# EAGLE design WordClock (EAGLE 6.0)
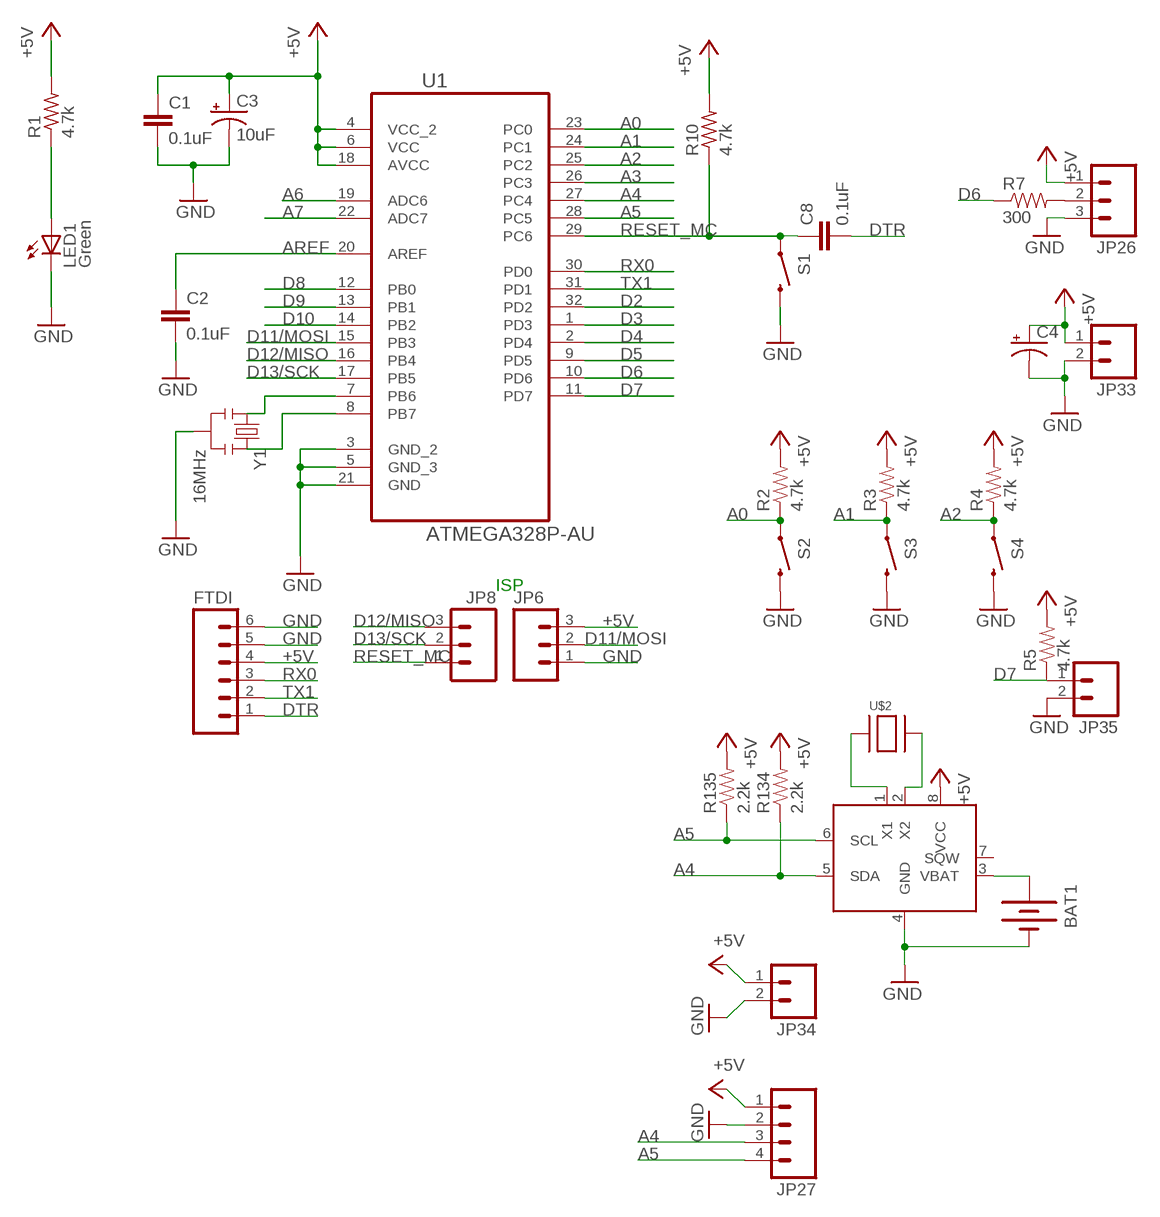
[diagram p0: schematic, sheet 1, part 1 of 2]
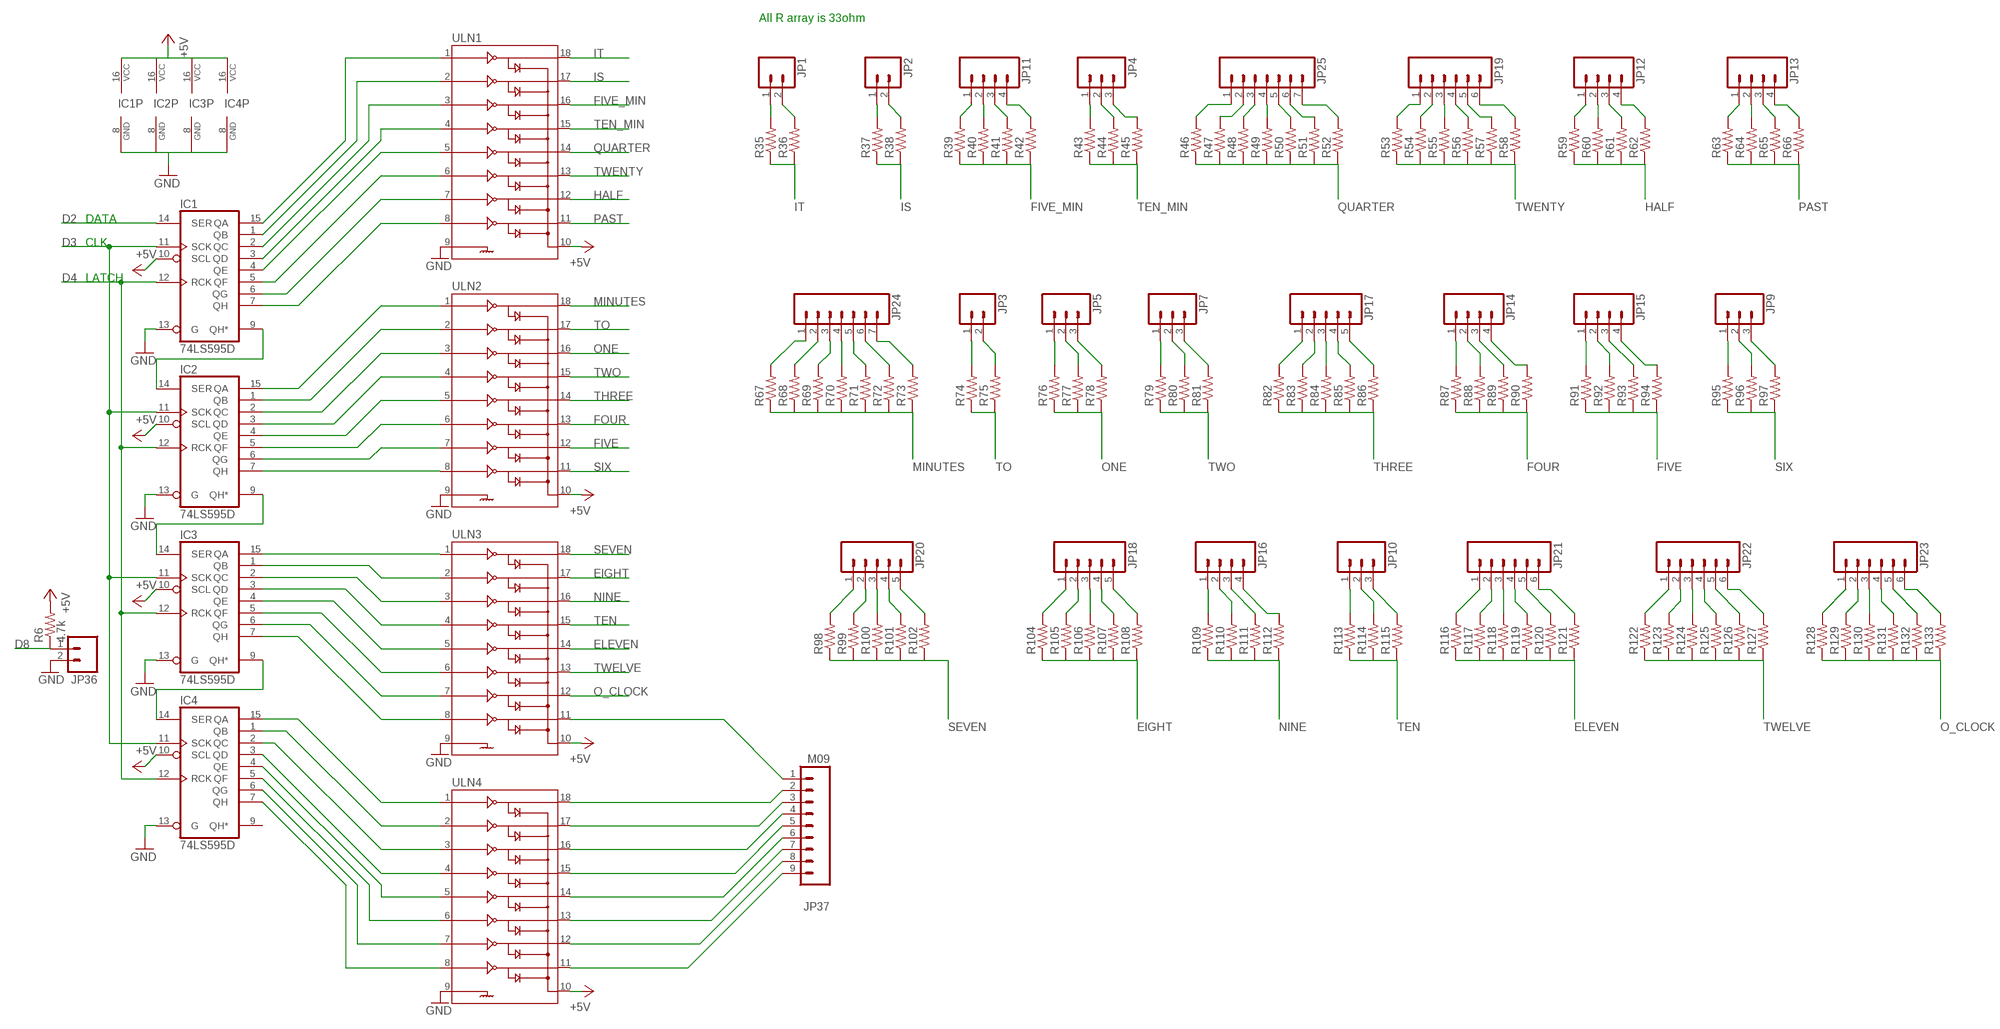
[diagram p1: schematic, sheet 1, part 2 of 2]

## Parts
BAT1  BATTERY12MM  [BATTCON_12MM]
C1  0.1uF  CAP0402-CAP  [0402-CAP]
C2  0.1uF  CAP0402-CAP  [0402-CAP]
C3  10uF  CAP_POL1206  [EIA3216]
C4  CPOL-USF  [PANASONIC_F]
C8  0.1uF  CAP0402-CAP  [0402-CAP]
FTDI  M06SIP  [1X06]
IC1  74LS595D  [SO16]
IC2  74LS595D  [SO16]
IC3  74LS595D  [SO16]
IC4  74LS595D  [SO16]
JP1  M02PTH  [1X02]
JP2  M02PTH  [1X02]
JP3  M02PTH  [1X02]
JP4  M03PTH  [1X03]
JP5  M03PTH  [1X03]
JP6  M03PTH  [1X03]
JP7  M03PTH  [1X03]
JP8  M03PTH  [1X03]
JP9  M03PTH  [1X03]
JP10  M03PTH  [1X03]
JP11  M04PTH  [1X04]
JP12  M04PTH  [1X04]
JP13  M04PTH  [1X04]
JP14  M04PTH  [1X04]
JP15  M04PTH  [1X04]
JP16  M04PTH  [1X04]
JP17  M05PTH  [1X05]
JP18  M05PTH  [1X05]
JP19  M06SIP  [1X06]
JP20  M05PTH  [1X05]
JP21  M06SIP  [1X06]
JP22  M06SIP  [1X06]
JP23  M06SIP  [1X06]
JP24  M07  [1X07]
JP25  M07  [1X07]
JP26  M03PTH  [1X03]
JP27  M04PTH  [1X04]
JP33  M02PTH  [1X02]
JP34  M02PTH  [1X02]
JP35  M02PTH  [1X02]
JP36  M02PTH  [1X02]
JP37  M09  [1X09]
LED1  Green  LED0603  [LED-0603]
R1  4.7k  R-US_R0603  [R0603]
R2  4.7k  RESISTOR0603-RES  [0603-RES]
R3  4.7k  RESISTOR0603-RES  [0603-RES]
R4  4.7k  RESISTOR0603-RES  [0603-RES]
R5  4.7k  RESISTOR0603-RES  [0603-RES]
R6  4.7k  RESISTOR0603-RES  [0603-RES]
R7  300  RESISTOR0603-RES  [0603-RES]
R10  4.7k  R-US_R0603  [R0603]
R35  RESISTOR0603-RES  [0603-RES]
R36  RESISTOR0603-RES  [0603-RES]
R37  RESISTOR0603-RES  [0603-RES]
R38  RESISTOR0603-RES  [0603-RES]
R39  RESISTOR0603-RES  [0603-RES]
R40  RESISTOR0603-RES  [0603-RES]
R41  RESISTOR0603-RES  [0603-RES]
R42  RESISTOR0603-RES  [0603-RES]
R43  RESISTOR0603-RES  [0603-RES]
R44  RESISTOR0603-RES  [0603-RES]
R45  RESISTOR0603-RES  [0603-RES]
R46  RESISTOR0603-RES  [0603-RES]
R47  RESISTOR0603-RES  [0603-RES]
R48  RESISTOR0603-RES  [0603-RES]
R49  RESISTOR0603-RES  [0603-RES]
R50  RESISTOR0603-RES  [0603-RES]
R51  RESISTOR0603-RES  [0603-RES]
R52  RESISTOR0603-RES  [0603-RES]
R53  RESISTOR0603-RES  [0603-RES]
R54  RESISTOR0603-RES  [0603-RES]
R55  RESISTOR0603-RES  [0603-RES]
R56  RESISTOR0603-RES  [0603-RES]
R57  RESISTOR0603-RES  [0603-RES]
R58  RESISTOR0603-RES  [0603-RES]
R59  RESISTOR0603-RES  [0603-RES]
R60  RESISTOR0603-RES  [0603-RES]
R61  RESISTOR0603-RES  [0603-RES]
R62  RESISTOR0603-RES  [0603-RES]
R63  RESISTOR0603-RES  [0603-RES]
R64  RESISTOR0603-RES  [0603-RES]
R65  RESISTOR0603-RES  [0603-RES]
R66  RESISTOR0603-RES  [0603-RES]
R67  RESISTOR0603-RES  [0603-RES]
R68  RESISTOR0603-RES  [0603-RES]
R69  RESISTOR0603-RES  [0603-RES]
R70  RESISTOR0603-RES  [0603-RES]
R71  RESISTOR0603-RES  [0603-RES]
R72  RESISTOR0603-RES  [0603-RES]
R73  RESISTOR0603-RES  [0603-RES]
R74  RESISTOR0603-RES  [0603-RES]
R75  RESISTOR0603-RES  [0603-RES]
R76  RESISTOR0603-RES  [0603-RES]
R77  RESISTOR0603-RES  [0603-RES]
R78  RESISTOR0603-RES  [0603-RES]
R79  RESISTOR0603-RES  [0603-RES]
R80  RESISTOR0603-RES  [0603-RES]
R81  RESISTOR0603-RES  [0603-RES]
R82  RESISTOR0603-RES  [0603-RES]
R83  RESISTOR0603-RES  [0603-RES]
R84  RESISTOR0603-RES  [0603-RES]
R85  RESISTOR0603-RES  [0603-RES]
R86  RESISTOR0603-RES  [0603-RES]
R87  RESISTOR0603-RES  [0603-RES]
R88  RESISTOR0603-RES  [0603-RES]
R89  RESISTOR0603-RES  [0603-RES]
R90  RESISTOR0603-RES  [0603-RES]
R91  RESISTOR0603-RES  [0603-RES]
R92  RESISTOR0603-RES  [0603-RES]
R93  RESISTOR0603-RES  [0603-RES]
R94  RESISTOR0603-RES  [0603-RES]
R95  RESISTOR0603-RES  [0603-RES]
R96  RESISTOR0603-RES  [0603-RES]
R97  RESISTOR0603-RES  [0603-RES]
R98  RESISTOR0603-RES  [0603-RES]
R99  RESISTOR0603-RES  [0603-RES]
R100  RESISTOR0603-RES  [0603-RES]
R101  RESISTOR0603-RES  [0603-RES]
R102  RESISTOR0603-RES  [0603-RES]
R104  RESISTOR0603-RES  [0603-RES]
R105  RESISTOR0603-RES  [0603-RES]
R106  RESISTOR0603-RES  [0603-RES]
R107  RESISTOR0603-RES  [0603-RES]
R108  RESISTOR0603-RES  [0603-RES]
R109  RESISTOR0603-RES  [0603-RES]
R110  RESISTOR0603-RES  [0603-RES]
R111  RESISTOR0603-RES  [0603-RES]
R112  RESISTOR0603-RES  [0603-RES]
R113  RESISTOR0603-RES  [0603-RES]
R114  RESISTOR0603-RES  [0603-RES]
R115  RESISTOR0603-RES  [0603-RES]
R116  RESISTOR0603-RES  [0603-RES]
R117  RESISTOR0603-RES  [0603-RES]
R118  RESISTOR0603-RES  [0603-RES]
R119  RESISTOR0603-RES  [0603-RES]
R120  RESISTOR0603-RES  [0603-RES]
R121  RESISTOR0603-RES  [0603-RES]
R122  RESISTOR0603-RES  [0603-RES]
R123  RESISTOR0603-RES  [0603-RES]
R124  RESISTOR0603-RES  [0603-RES]
R125  RESISTOR0603-RES  [0603-RES]
R126  RESISTOR0603-RES  [0603-RES]
R127  RESISTOR0603-RES  [0603-RES]
R128  RESISTOR0603-RES  [0603-RES]
R129  RESISTOR0603-RES  [0603-RES]
R130  RESISTOR0603-RES  [0603-RES]
R131  RESISTOR0603-RES  [0603-RES]
R132  RESISTOR0603-RES  [0603-RES]
R133  RESISTOR0603-RES  [0603-RES]
R134  2.2k  RESISTOR0603-RES  [0603-RES]
R135  2.2k  RESISTOR0603-RES  [0603-RES]
S1  SWITCH-MOMENTARY-2  [TACTILE_SWITCH_TALL]
S2  SWITCH-MOMENTARY-2  [TACTILE_SWITCH_TALL]
S3  SWITCH-MOMENTARY-2  [TACTILE_SWITCH_TALL]
S4  SWITCH-MOMENTARY-2  [TACTILE_SWITCH_TALL]
U1  ATMEGA328P-AU  [QFP80P900X900X120-32N]
U$1  DS1307  [8-SOIC]
U$2  CRYSTAL-32.768K  [4-SOJ]
ULN1  ULN2803SOICW  [SO18L]
ULN2  ULN2803SOICW  [SO18L]
ULN3  ULN2803SOICW  [SO18L]
ULN4  ULN2803SOICW  [SO18L]
Y1  16MHz  RESONATORSMD  [RESONATOR-SMD]

## Nets
+5V: C1.1 C3.A(+) C4.+ FTDI.4 IC1.10(SCL) IC1.16(VCC) IC2.10(SCL) IC2.16(VCC) IC3.10(SCL) IC3.16(VCC) IC4.10(SCL) IC4.16(VCC) JP6.3 JP26.1 JP27.1 JP33.1 JP34.1 R1.2 R2.2 R3.2 R4.2 R5.2 R6.2 R10.2 R134.2 R135.2 U1.4(VCC_2) U1.6(VCC) U1.18(AVCC) U$1.8(VCC) ULN1.10 ULN2.10 ULN3.10 ULN4.10
A0: R2.1 S2.A2 U1.23(PC0)
A1: R3.1 S3.A2 U1.24(PC1)
A2: R4.1 S4.A2 U1.25(PC2)
A3: U1.26(PC3)
A4: JP27.3 R134.1 U1.27(PC4) U$1.5(SDA)
A5: JP27.4 R135.1 U1.28(PC5) U$1.6(SCL)
A6: U1.19(ADC6)
A7: U1.22(ADC7)
AREF: C2.1 U1.20(AREF)
D2: IC1.14(SER) U1.32(PD2)
D3: IC1.11(SCK) IC2.11(SCK) IC3.11(SCK) IC4.11(SCK) U1.1(PD3)
D4: IC1.12(RCK) IC2.12(RCK) IC3.12(RCK) IC4.12(RCK) U1.2(PD4)
D5: U1.9(PD5)
D6: R7.1 U1.10(PD6)
D7: JP35.1 R5.1 U1.11(PD7)
D8: JP36.1 R6.1 U1.12(PB0)
D9: U1.13(PB1)
D10: U1.14(PB2)
D11/MOSI: JP6.2 U1.15(PB3)
D12/MISO: JP8.3 U1.16(PB4)
D13/SCK: JP8.2 U1.17(PB5)
DTR: C8.2 FTDI.1
EIGHT: R104.1 R105.1 R106.1 R107.1 R108.1 ULN3.17
ELEVEN: R116.1 R117.1 R118.1 R119.1 R120.1 R121.1 ULN3.14
FIVE: R91.1 R92.1 R93.1 R94.1 ULN2.12
FIVE_MIN: R39.1 R40.1 R41.1 R42.1 ULN1.16
FOUR: R87.1 R88.1 R89.1 R90.1 ULN2.13
GND: BAT1.GND(-) C1.2 C2.2 C3.C(-) C4.- FTDI.5 FTDI.6 IC1.8(GND) IC1.13(G) IC2.8(GND) IC2.13(G) IC3.8(GND) IC3.13(G) IC4.8(GND) IC4.13(G) JP6.1 JP26.3 JP27.2 JP33.2 JP34.2 JP35.2 JP36.2 LED1.C S1.B2 S2.B2 S3.B2 S4.B2 U1.3(GND_2) U1.5(GND_3) U1.21(GND) U$1.4(GND) ULN1.9 ULN2.9 ULN3.9 ULN4.9 Y1.2
HALF: R59.1 R60.1 R61.1 R62.1 ULN1.12
IS: R37.1 R38.1 ULN1.17
IT: R35.1 R36.1 ULN1.18
MINUTES: R67.1 R68.1 R69.1 R70.1 R71.1 R72.1 R73.1 ULN2.18
N$1: U1.7(PB6) Y1.1
N$2: LED1.A R1.1
N$3: U1.8(PB7) Y1.3
N$4: BAT1.PWR@1(+) U$1.3(VBAT)
N$5: IC1.9(QH*) IC2.14(SER)
N$6: IC2.9(QH*) IC3.14(SER)
N$7: IC3.9(QH*) IC4.14(SER)
N$8: U$1.2(X2) U$2.P$4
N$9: U$1.1(X1) U$2.P$1
N$10: JP37.1 ULN3.11
N$11: JP37.2 ULN4.18
N$12: JP37.3 ULN4.17
N$13: JP37.4 ULN4.16
N$14: JP37.5 ULN4.15
N$15: JP37.6 ULN4.14
N$16: JP37.7 ULN4.13
N$17: JP37.8 ULN4.12
N$18: JP37.9 ULN4.11
N$19: JP26.2 R7.2
N$42: IC2.7(QH) ULN2.8
N$43: IC2.6(QG) ULN2.7
N$44: IC2.5(QF) ULN2.6
N$45: IC2.4(QE) ULN2.5
N$46: IC2.3(QD) ULN2.4
N$47: IC2.2(QC) ULN2.3
N$48: IC2.1(QB) ULN2.2
N$49: IC2.15(QA) ULN2.1
N$50: IC1.7(QH) ULN1.8
N$51: IC1.6(QG) ULN1.7
N$52: IC1.5(QF) ULN1.6
N$53: IC1.4(QE) ULN1.5
N$54: IC3.15(QA) ULN3.1
N$55: IC3.1(QB) ULN3.2
N$56: IC3.2(QC) ULN3.3
N$57: IC3.3(QD) ULN3.4
N$58: IC3.4(QE) ULN3.5
N$59: IC3.5(QF) ULN3.6
N$60: IC3.6(QG) ULN3.7
N$61: IC3.7(QH) ULN3.8
N$62: IC1.3(QD) ULN1.4
N$63: IC1.2(QC) ULN1.3
N$64: IC1.1(QB) ULN1.2
N$65: IC1.15(QA) ULN1.1
N$66: IC4.15(QA) ULN4.1
N$67: IC4.1(QB) ULN4.2
N$68: IC4.2(QC) ULN4.3
N$69: IC4.3(QD) ULN4.4
N$70: IC4.4(QE) ULN4.5
N$71: IC4.5(QF) ULN4.6
N$72: IC4.6(QG) ULN4.7
N$73: IC4.7(QH) ULN4.8
N$74: JP1.1 R35.2
N$75: JP1.2 R36.2
N$76: JP2.1 R37.2
N$77: JP2.2 R38.2
N$78: JP3.1 R74.2
N$79: JP3.2 R75.2
N$80: JP4.1 R43.2
N$81: JP4.2 R44.2
N$82: JP4.3 R45.2
N$83: JP5.1 R76.2
N$84: JP5.2 R77.2
N$85: JP5.3 R78.2
N$86: JP7.1 R79.2
N$87: JP7.2 R80.2
N$88: JP7.3 R81.2
N$89: JP14.1 R87.2
N$90: JP14.2 R88.2
N$91: JP14.3 R89.2
N$92: JP14.4 R90.2
N$93: JP15.1 R91.2
N$94: JP15.2 R92.2
N$95: JP15.3 R93.2
N$96: JP15.4 R94.2
N$97: JP9.1 R95.2
N$98: JP9.2 R96.2
N$99: JP9.3 R97.2
N$100: JP16.1 R109.2
N$101: JP16.2 R110.2
N$102: JP16.3 R111.2
N$103: JP16.4 R112.2
N$104: JP10.1 R113.2
N$105: JP10.2 R114.2
N$106: JP10.3 R115.2
N$107: JP25.1 R46.2
N$108: JP25.2 R47.2
N$109: JP25.3 R48.2
N$110: JP25.4 R49.2
N$111: JP25.5 R50.2
N$112: JP25.6 R51.2
N$113: JP25.7 R52.2
N$114: JP19.1 R53.2
N$115: JP19.2 R54.2
N$116: JP19.3 R55.2
N$117: JP19.4 R56.2
N$118: JP19.5 R57.2
N$119: JP19.6 R58.2
N$120: JP12.1 R59.2
N$121: JP12.2 R60.2
N$122: JP12.3 R61.2
N$123: JP12.4 R62.2
N$124: JP13.1 R63.2
N$125: JP13.2 R64.2
N$126: JP13.3 R65.2
N$127: JP13.4 R66.2
N$128: JP24.1 R67.2
N$129: JP24.2 R68.2
N$130: JP24.3 R69.2
N$131: JP24.4 R70.2
N$132: JP24.5 R71.2
N$133: JP24.6 R72.2
N$134: JP24.7 R73.2
N$135: JP17.1 R82.2
N$136: JP17.2 R83.2
N$137: JP17.3 R84.2
N$138: JP17.4 R85.2
N$139: JP17.5 R86.2
N$140: JP20.1 R98.2
N$141: JP20.2 R99.2
N$142: JP20.3 R100.2
N$143: JP20.4 R101.2
N$144: JP20.5 R102.2
N$146: JP18.1 R104.2
N$147: JP18.2 R105.2
N$148: JP18.3 R106.2
N$149: JP18.4 R107.2
N$150: JP18.5 R108.2
N$151: JP21.1 R116.2
N$152: JP21.2 R117.2
N$153: JP21.3 R118.2
N$154: JP21.4 R119.2
N$155: JP21.5 R120.2
N$156: JP21.6 R121.2
N$157: JP22.1 R122.2
N$158: JP22.2 R123.2
N$159: JP22.3 R124.2
N$160: JP22.4 R125.2
N$161: JP22.5 R126.2
N$162: JP22.6 R127.2
N$163: JP23.1 R128.2
N$164: JP23.2 R129.2
N$165: JP23.3 R130.2
N$166: JP23.4 R131.2
N$167: JP23.5 R132.2
N$168: JP23.6 R133.2
N$169: JP11.1 R39.2
N$170: JP11.2 R40.2
N$171: JP11.3 R41.2
N$172: JP11.4 R42.2
NINE: R109.1 R110.1 R111.1 R112.1 ULN3.16
O_CLOCK: R128.1 R129.1 R130.1 R131.1 R132.1 R133.1 ULN3.12
ONE: R76.1 R77.1 R78.1 ULN2.16
PAST: R63.1 R64.1 R65.1 R66.1 ULN1.11
QUARTER: R46.1 R47.1 R48.1 R49.1 R50.1 R51.1 R52.1 ULN1.14
RESET_MC: C8.1 JP8.1 R10.1 S1.A2 U1.29(PC6)
RX0: FTDI.3 U1.30(PD0)
SEVEN: R98.1 R99.1 R100.1 R101.1 R102.1 ULN3.18
SIX: R95.1 R96.1 R97.1 ULN2.11
TEN: R113.1 R114.1 R115.1 ULN3.15
TEN_MIN: R43.1 R44.1 R45.1 ULN1.15
THREE: R82.1 R83.1 R84.1 R85.1 R86.1 ULN2.14
TO: R74.1 R75.1 ULN2.17
TWELVE: R122.1 R123.1 R124.1 R125.1 R126.1 R127.1 ULN3.13
TWENTY: R53.1 R54.1 R55.1 R56.1 R57.1 R58.1 ULN1.13
TWO: R79.1 R80.1 R81.1 ULN2.15
TX1: FTDI.2 U1.31(PD1)
Unconnected: IC4.9(QH*) U$1.7(SQW)

## Notes on the sheet
- All R array is 33ohm
- DATA
- CLK
- LATCH
- ISP

## Library data of the parts
BAT1 = SparkFun-Electromechanical:BATTERY: Battery Holders Various common sizes : AA, AAA, 20mm coin cell and 12mm coin cell.
C1 C2 C8 = SparkFun-Passives:CAP: Capacitor Standard 0603 ceramic capacitor, and 0.1" leaded capacitor.
C3 = SparkFun-Passives:CAP_POL: Capacitor Polarized These are standard SMD and PTH capacitors. Normally 10uF, 47uF, and 100uF in electrolytic and tantalum varieties. Always verify the external diameter of the through hole cap, it varies with capacity, voltage, and manufacturer. The EIA devices should be standard.
C4 = rcl:CPOL-US: POLARIZED CAPACITOR, American symbol
FTDI JP19 JP21-JP23 = SparkFun-Connectors:M06: Header 6 Standard 6-pin 0.1" header. Use with straight break away headers (SKU : PRT-00116), right angle break away headers (PRT-00553), swiss pins (PRT-00743), machine pins (PRT-00117), and female headers (PRT-00115). Molex polarized connector foot print use with SKU : PRT-08094 with associated crimp pins and housings. NOTES ON THE VARIANTS LOCK and LOCK_LONGPADS... This footprint was designed to help hold the alignment of a through-hole component (i.e. 6-pin header) while soldering it into place. You may notice that each hole has been shifted either up or down by 0.005 of an inch from it's more standard position (which is a perfectly straight line). This slight alteration caused the pins (the squares in the middle) to touch the edges of the holes. Because they are alternating, it causes a "brace" to hold the component in place. 0.005 has proven to be the perfect amount of "off-center" position when using our standard breakaway headers. Although looks a little odd when you look at the bare footprint, once you have a header in there, the alteration is very hard to notice. Also, if you push a header all the way into place, it is covered up entirely on the bottom side. This idea of altering the position of holes to aid alignment will be further integrated into the Sparkfun Library for other footprints. It can help hold any component with 3 or more connection pins.
IC1-IC4 = 74xx-us:74*595: 8-bit SHIFT REGISTER, output latch
JP1-JP3 JP33-JP36 = SparkFun-Connectors:M02: Header 2 Standard 2-pin 0.1" header. Use with straight break away headers (SKU : PRT-00116), right angle break away headers (PRT-00553), swiss pins (PRT-00743), machine pins (PRT-00117), and female headers (PRT-00115). Molex polarized connector foot print use with SKU : PRT-08233 with associated crimp pins and housings.
JP4-JP10 JP26 = SparkFun-Connectors:M03: Header 3 Standard 3-pin 0.1" header. Use with straight break away headers (SKU : PRT-00116), right angle break away headers (PRT-00553), swiss pins (PRT-00743), machine pins (PRT-00117), and female headers (PRT-00115). Molex polarized connector foot print use with SKU : PRT-08232 with associated crimp pins and housings.
JP11-JP16 JP27 = SparkFun-Connectors:M04: Header 4 Standard 4-pin 0.1" header. Use with straight break away headers (SKU : PRT-00116), right angle break away headers (PRT-00553), swiss pins (PRT-00743), machine pins (PRT-00117), and female headers (PRT-00115). Molex polarized connector foot print use with SKU : PRT-08231 with associated crimp pins and housings. 1MM SMD Version SKU: PRT-10208
JP17 JP18 JP20 = SparkFun-Connectors:M05: Header 5 Standard 5-pin 0.1" header. Use with straight break away headers (SKU : PRT-00116), right angle break away headers (PRT-00553), swiss pins (PRT-00743), machine pins (PRT-00117), and female headers (PRT-00115). Molex polarized connector foot print use with SKU : PRT-08230 with associated crimp pins and housings.
JP24 JP25 = SparkFun-Connectors:M07: Header 7 Standard 7-pin 0.1" header. Use with straight break away headers (SKU : PRT-00116), right angle break away headers (PRT-00553), swiss pins (PRT-00743), machine pins (PRT-00117), and female headers (PRT-00115). NOTES ON THE VARIANTS LOCK and LOCK_LONGPADS... This footprint was designed to help hold the alignment of a through-hole component (i.e. 7-pin header) while soldering it into place. You may notice that each hole has been shifted either up or down by 0.005 of an inch from it's more standard position (which is usually a perfectly straight line). This slight alteration caused the pins (the squares in the middle) to touch the edges of the holes. Because they are alternating, it causes a "brace" to hold the header in place. 0.005 has proven to be the perfect amount of "off-center" position when using our standard breakaway headers. Although looks a little odd when you look at the bare footprint, once you have a header in there, the alteration is very hard to notice. Also, if you push a header all the way into place, it is covered up entirely on the bottom side. This idea of altering the position of holes to aid alignment will be further integrated into the Sparkfun Library for other footprints. It can help hold any component with 3 or more connection pins.
JP37 = SparkFun-Connectors:M09: Header 9 Standard 9-pin 0.1" header. Use with straight break away headers (SKU : PRT-00116), right angle break away headers (PRT-00553), swiss pins (PRT-00743), machine pins (PRT-00117), and female headers (PRT-00115).
LED1 = SparkFun-LED:LED: LEDs Standard schematic elements and footprints for 5mm, 3mm, 1206, and 0603 sized LEDs. 5mm - Spark Fun Electronics SKU : COM-00529 (and others)
R1 R10 = resistor:R-US_: RESISTOR, American symbol
R2-R7 R35-R102 R104-R135 = SparkFun-Passives:RESISTOR: Resistor Basic schematic elements and footprints for 0603, 1206, and PTH resistors.
S1-S4 = SparkFun-Electromechanical:SWITCH-MOMENTARY-2: Various NO switches- pushbuttons, reed, etc
U1 = Atmel_By_element14_Batch_1:ATMEGA328P-AU: 8-bit Microcontroller with In-System Programmable Flash; MPN: ATMEGA328P-AU; OC_FARNELL: 1715486; OC_NEWARK: 14R4631; PACKAGE: TQFP-32; SUPPLIER: Atmel
U$1 = my-custom-parts:DS1307
U$2 = my-custom-parts:CRYSTAL-32.768K
ULN1-ULN4 = SparkFun-PowerIC:ULN2803: Darlington Driver ULN2803 Darlington array. 500mA max per channel, 8-channel package. Spark Fun Electronics SKU : COM-00312
Y1 = SparkFun-FreqCtrl:RESONATOR: Resonator Small SMD resonator. This is the itty bitty 10/20MHz resonators with built in caps. CSTCE10M0G55 and CSTCE20M0V53. Footprint has been reviewed closely but hasn't been tested yet.

## Net classes
1 pwr12: width 0.762 mm, drill 0.254 mm, clearance 0.381 mm

## Board
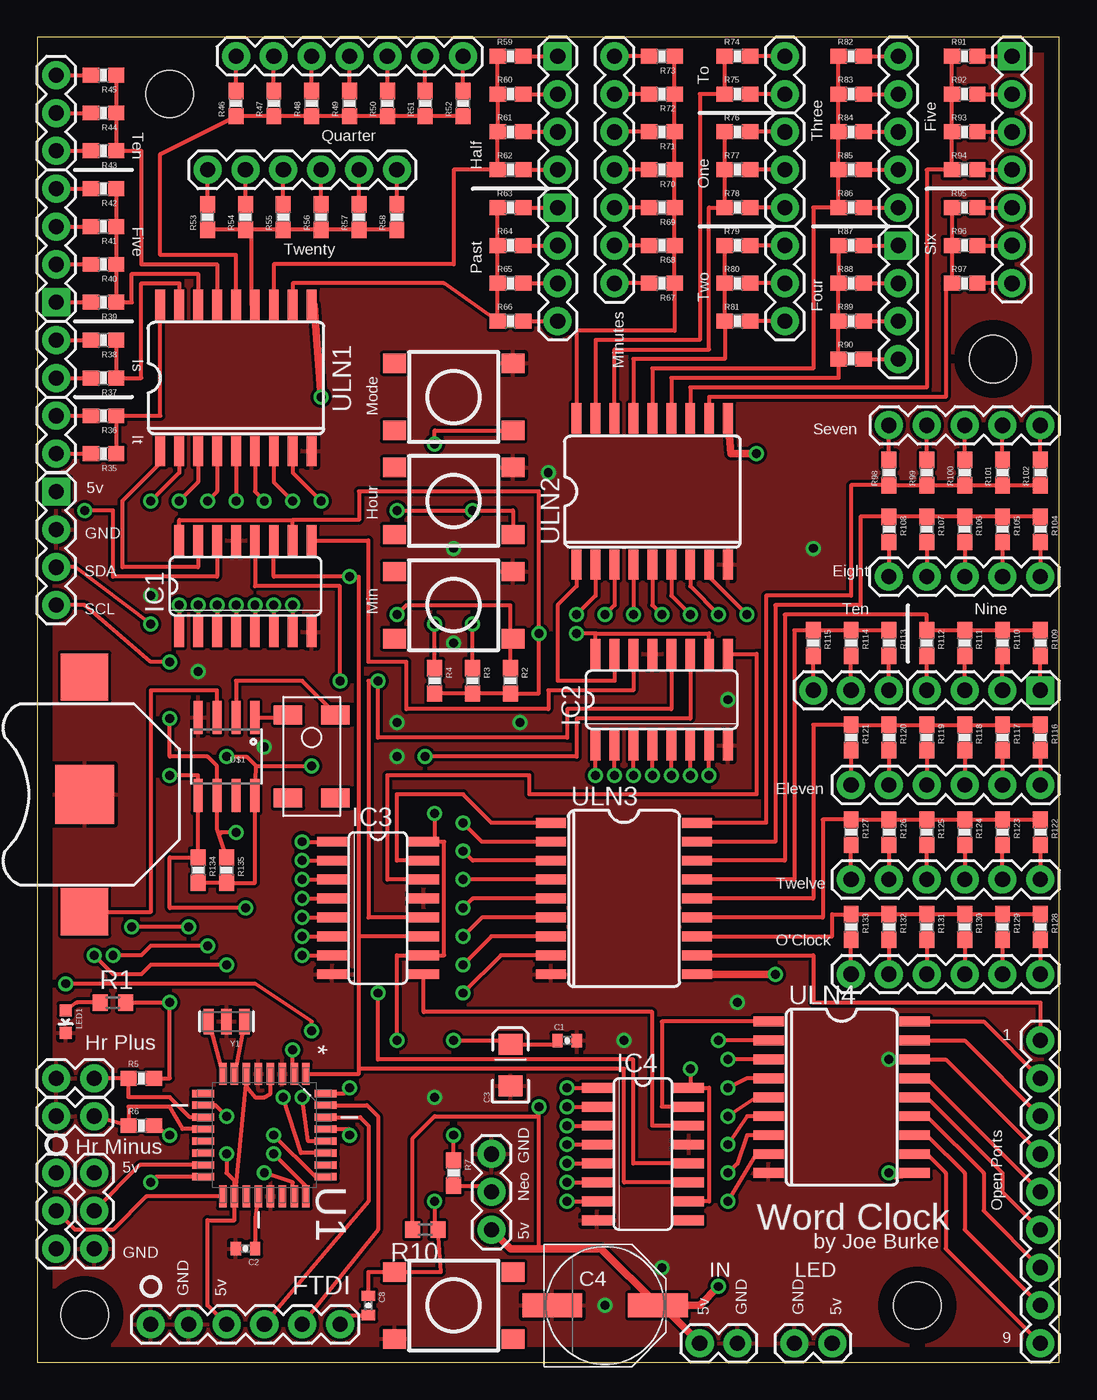
[diagram p2: board, top side]
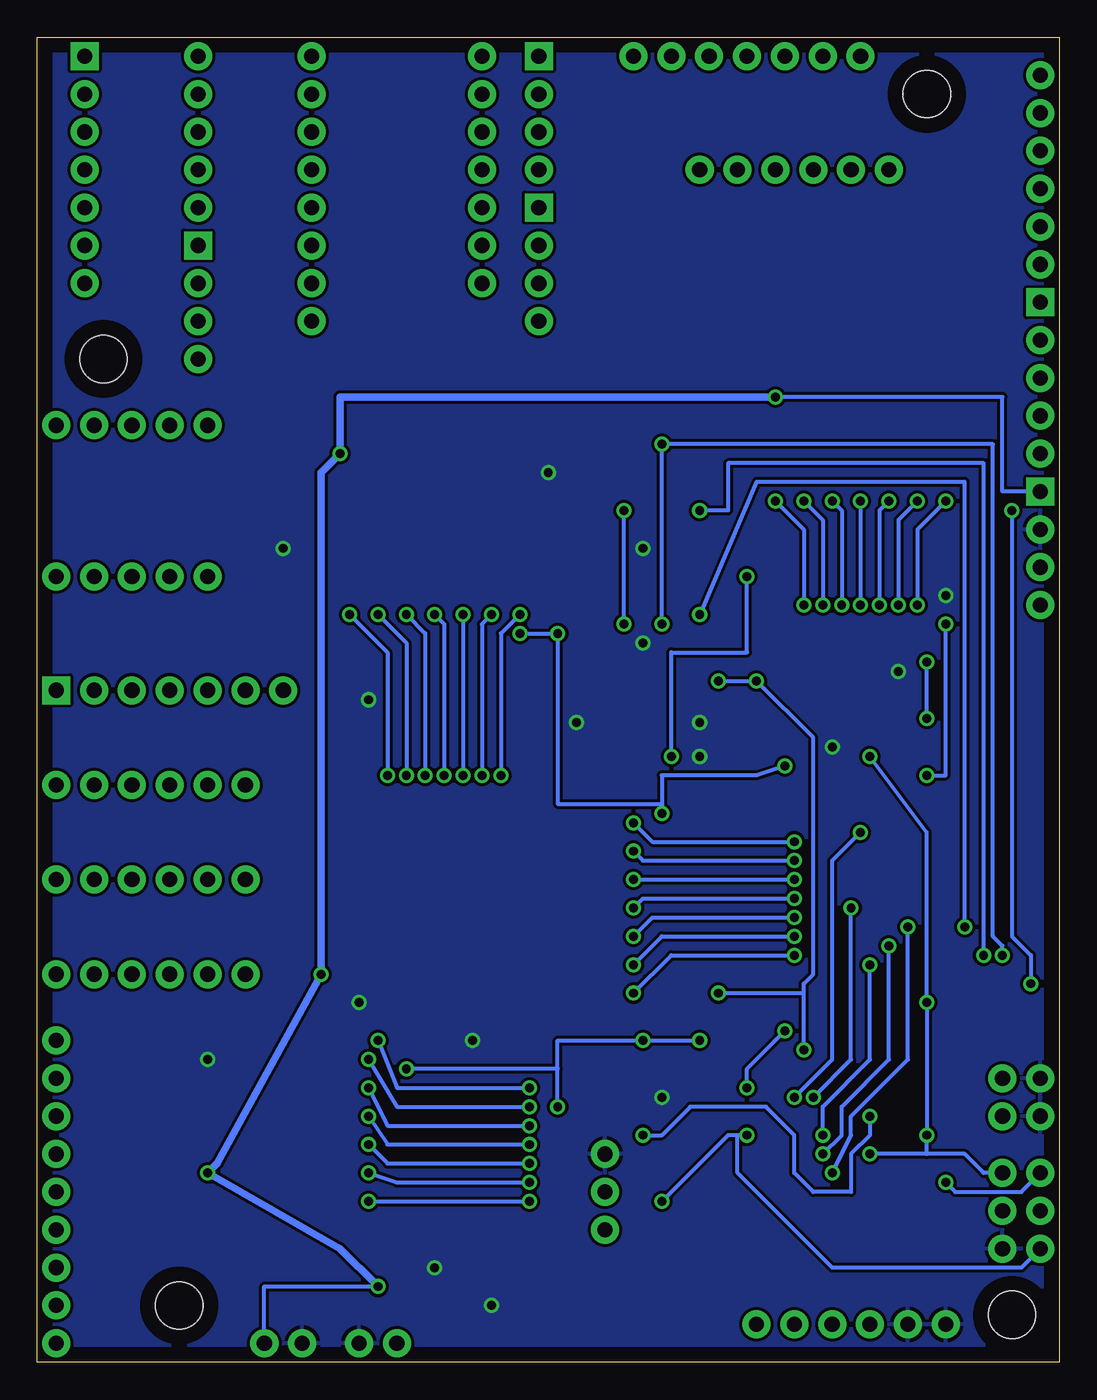
[diagram p3: board, bottom side, seen from below]

Size 68.58 x 88.9 mm. Coordinates in mm from the lower left corner, seen from the top.
Outline: 0,0 68.58,0 68.58,88.9 0,88.9 0,0
Copper layers (1*16): Top 0.035mm / dielectric 1.5mm / Bottom 0.035mm
Design rules: minimum track width 10mil, minimum drill 24mil, track to track 8mil, track to pad 8mil, pad to pad 8mil, via to via 8mil, smd to smd 8mil, copper to edge 40mil, drill to drill 8mil, minimum pad ring 10mil, minimum via ring 8mil, stop-mask expansion 4mil, vias tented up to drill 0mil, thermal gap 10mil
Holes 3.17 mm at 64.14,67.31 3.17,3.17 8.89,85.09 59.05,3.81

### Footprints (pad centres in the part's own frame; a part is rotated, then mirrored left to right if it is on the bottom)
BATTCON_12MM = smd 3.962 x 3.962: GND 0,0 | smd 3.175 x 3.175: PWR@1 -7.874,0; PWR@2 7.874,0
0402-CAP = smd 0.7 x 0.9: 1 -0.65,0; 2 0.65,0
EIA3216 = smd 1.4 x 1.6: A 1.4,0; C -1.4,0
PANASONIC_F = smd 4 x 1.6: + 3.55,0; - -3.55,0
1X06 = drill 1.016 pad 1.88: 1 0,0; 2 2.54,0; 3 5.08,0; 4 7.62,0; 5 10.16,0; 6 12.7,0
SO16 = smd 0.66 x 2.032: 1 -4.445,-3.073; 2 -3.175,-3.073; 3 -1.905,-3.073; 4 -0.635,-3.073; 5 0.635,-3.073; 6 1.905,-3.073; 7 3.175,-3.073; 8 4.445,-3.073; 9 4.445,3.073; 10 3.175,3.073; 11 1.905,3.073; 12 0.635,3.073; 13 -0.635,3.073; 14 -1.905,3.073; 15 -3.175,3.073; 16 -4.445,3.073
1X02 = drill 1.016 pad 1.88: 1 0,0; 2 2.54,0
1X03 = drill 1.016 pad 1.88: 1 0,0; 2 2.54,0; 3 5.08,0
1X04 = drill 1.016 pad 1.88 square: 1 0,0 | drill 1.016 pad 1.88: 2 2.54,0; 3 5.08,0; 4 7.62,0
1X05 = drill 1.016 pad 1.88: 1 0,0; 2 2.54,0; 3 5.08,0; 4 7.62,0; 5 10.16,0
1X07 = drill 1.016 pad 1.88: 1 0,0; 2 2.54,0; 3 5.08,0; 4 7.62,0; 5 10.16,0; 6 12.7,0; 7 15.24,0
1X09 = drill 1.016 pad 1.88: 1 0,0; 2 2.54,0; 3 5.08,0; 4 7.62,0; 5 10.16,0; 6 12.7,0; 7 15.24,0; 8 17.78,0; 9 20.32,0
LED-0603 = smd 0.8 x 0.8: A 0,-0.75; C 0,0.75
R0603 = smd 1 x 1.1: 1 -0.85,0; 2 0.85,0
0603-RES = smd 1.1 x 1: 1 -0.85,0; 2 0.85,0
TACTILE_SWITCH_TALL = smd 1.55 x 1.3: A1 -3.975,-2.25; A2 3.975,-2.25; B1 -3.975,2.25; B2 3.975,2.25
QFP80P900X900X120-32N = smd 1.473 x 0.508: 1 -4.115,2.794; 2 -4.115,2.007; 3 -4.115,1.194; 4 -4.115,0.406; 5 -4.115,-0.406; 6 -4.115,-1.194; 7 -4.115,-2.007; 8 -4.115,-2.794; 17 4.115,-2.794; 18 4.115,-2.007; 19 4.115,-1.194; 20 4.115,-0.406; 21 4.115,0.406; 22 4.115,1.194; 23 4.115,2.007; 24 4.115,2.794 | smd 0.508 x 1.473: 9 -2.794,-4.115; 10 -2.007,-4.115; 11 -1.194,-4.115; 12 -0.406,-4.115; 13 0.406,-4.115; 14 1.194,-4.115; 15 2.007,-4.115; 16 2.794,-4.115; 25 2.794,4.115; 26 2.007,4.115; 27 1.194,4.115; 28 0.406,4.115; 29 -0.406,4.115; 30 -1.194,4.115; 31 -2.007,4.115; 32 -2.794,4.115
8-SOIC = smd 0.61 x 2.21: 1 -1.905,-2.616; 2 -0.635,-2.616; 3 0.635,-2.616; 4 1.905,-2.616; 5 1.905,2.616; 6 0.635,2.616; 7 -0.635,2.616; 8 -1.905,2.616
4-SOJ = smd 1.27 x 1.905: P$1 -2.794,-1.587; P$2 2.794,-1.587; P$3 2.794,1.587; P$4 -2.794,1.587
SO18L = smd 0.66 x 2.032: 1 -0.635,-4.902; 2 0.635,-4.902; 3 1.905,-4.902; 4 3.175,-4.902; 5 4.445,-4.902; 6 5.715,-4.902; 7 6.985,-4.902; 8 8.255,-4.902; 9 9.525,-4.902; 10 9.525,4.902; 11 8.255,4.902; 12 6.985,4.902; 13 5.715,4.902; 14 4.445,4.902; 15 3.175,4.902; 16 1.905,4.902; 17 0.635,4.902; 18 -0.635,4.902
RESONATOR-SMD = smd 0.7 x 1.7: 1 -1.2,0; 2 0,0; 3 1.2,0

### Placement (x,y rotation side)
BAT1  3.17,38.1 90 top
C1  35.56,21.59 0 top
C2  13.97,7.62 180 top
C3  31.75,19.94 90 top
C4  38.1,3.81 0 top
C8  22.23,3.81 270 top
FTDI  20.32,2.54 180 top
IC1  13.97,52.07 0 top
IC2  41.91,44.45 0 top
IC3  22.86,30.48 270 top
IC4  40.64,13.97 270 top
JP1  1.27,60.96 90 top
JP2  1.27,66.04 90 top
JP3  50.16,87.63 270 top
JP4  1.27,81.28 90 top
JP5  50.16,82.55 270 top
JP6  3.81,7.62 90 top
JP7  50.16,74.93 270 top
JP8  1.27,7.62 90 top
JP9  65.41,77.47 270 top
JP10  57.15,45.09 180 top
JP11  1.27,71.12 90 top
JP12  34.92,87.63 270 top
JP13  34.92,77.47 270 top
JP14  57.78,74.93 270 top
JP15  65.41,87.63 270 top
JP16  67.31,45.09 180 top
JP17  57.78,87.63 270 top
JP18  67.31,52.7 180 top
JP19  11.43,80.01 0 top
JP20  57.15,62.87 0 top
JP21  67.31,38.73 180 top
JP22  67.31,32.38 180 top
JP23  67.31,26.04 180 top
JP24  38.73,72.39 90 top
JP25  13.34,87.63 0 top
JP26  30.48,8.89 90 top
JP27  1.27,58.42 270 top
JP33  44.45,1.27 0 top
JP34  53.34,1.27 180 top
JP35  3.81,19.05 180 top
JP36  3.81,16.51 180 top
JP37  67.31,21.59 270 top
LED1  1.91,22.86 180 top
R1  5.08,24.13 0 top
R2  31.75,45.72 270 top
R3  29.21,45.72 270 top
R4  26.67,45.72 270 top
R5  6.99,19.05 0 top
R6  6.99,15.88 0 top
R7  27.94,12.7 270 top
R10  26.04,8.89 180 top
R35  4.45,60.96 180 top
R36  4.45,63.5 180 top
R37  4.45,66.04 180 top
R38  4.45,68.58 180 top
R39  4.45,71.12 180 top
R40  4.45,73.66 180 top
R41  4.45,76.2 180 top
R42  4.45,78.74 180 top
R43  4.45,81.28 180 top
R44  4.45,83.82 180 top
R45  4.45,86.36 180 top
R46  13.34,84.45 90 top
R47  15.88,84.45 90 top
R48  18.41,84.45 90 top
R49  20.95,84.45 90 top
R50  23.5,84.45 90 top
R51  26.04,84.45 90 top
R52  28.57,84.45 90 top
R53  11.43,76.83 90 top
R54  13.97,76.83 90 top
R55  16.51,76.83 90 top
R56  19.05,76.83 90 top
R57  21.59,76.83 90 top
R58  24.13,76.83 90 top
R59  31.75,87.63 0 top
R60  31.75,85.09 0 top
R61  31.75,82.55 0 top
R62  31.75,80.01 0 top
R63  31.75,77.47 0 top
R64  31.75,74.93 0 top
R65  31.75,72.39 0 top
R66  31.75,69.85 0 top
R67  41.91,72.39 180 top
R68  41.91,74.93 180 top
R69  41.91,77.47 180 top
R70  41.91,80.01 180 top
R71  41.91,82.55 180 top
R72  41.91,85.09 180 top
R73  41.91,87.63 180 top
R74  46.99,87.63 0 top
R75  46.99,85.09 0 top
R76  46.99,82.55 0 top
R77  46.99,80.01 0 top
R78  46.99,77.47 0 top
R79  46.99,74.93 0 top
R80  46.99,72.39 0 top
R81  46.99,69.85 0 top
R82  54.61,87.63 0 top
R83  54.61,85.09 0 top
R84  54.61,82.55 0 top
R85  54.61,80.01 0 top
R86  54.61,77.47 0 top
R87  54.61,74.93 0 top
R88  54.61,72.39 0 top
R89  54.61,69.85 0 top
R90  54.61,67.31 0 top
R91  62.23,87.63 0 top
R92  62.23,85.09 0 top
R93  62.23,82.55 0 top
R94  62.23,80.01 0 top
R95  62.23,77.47 0 top
R96  62.23,74.93 0 top
R97  62.23,72.39 0 top
R98  57.15,59.69 90 top
R99  59.69,59.69 90 top
R100  62.23,59.69 90 top
R101  64.77,59.69 90 top
R102  67.31,59.69 90 top
R104  67.31,55.88 270 top
R105  64.77,55.88 270 top
R106  62.23,55.88 270 top
R107  59.69,55.88 270 top
R108  57.15,55.88 270 top
R109  67.31,48.26 270 top
R110  64.77,48.26 270 top
R111  62.23,48.26 270 top
R112  59.69,48.26 270 top
R113  57.15,48.26 270 top
R114  54.61,48.26 270 top
R115  52.07,48.26 270 top
R116  67.31,41.91 270 top
R117  64.77,41.91 270 top
R118  62.23,41.91 270 top
R119  59.69,41.91 270 top
R120  57.15,41.91 270 top
R121  54.61,41.91 270 top
R122  67.31,35.56 270 top
R123  64.77,35.56 270 top
R124  62.23,35.56 270 top
R125  59.69,35.56 270 top
R126  57.15,35.56 270 top
R127  54.61,35.56 270 top
R128  67.31,29.21 270 top
R129  64.77,29.21 270 top
R130  62.23,29.21 270 top
R131  59.69,29.21 270 top
R132  57.15,29.21 270 top
R133  54.61,29.21 270 top
R134  10.79,33.02 270 top
R135  12.7,33.02 270 top
S1  27.94,3.81 180 top
S2  27.94,50.8 0 top
S3  27.94,57.78 0 top
S4  27.94,64.77 0 top
U1  15.24,15.24 270 top
U$1  12.7,40.64 180 top
U$2  18.41,40.64 270 top
ULN1  8.89,66.04 0 top
ULN2  36.83,58.42 0 top
ULN3  39.37,35.56 270 top
ULN4  53.98,22.23 270 top
Y1  12.7,22.86 180 top

### Tracks (layer width: path | path; a pad name or v marks a point on that pad's centre or on a via)
+5V  (via drill 0.6)
  Top 0.254: IC1.16 9.53,56.52 17.14,56.52 | IC1.10 17.14,56.52 | IC2.16 37.47,48.9 | 37.47,48.9 45.09,48.9 IC2.10 | 26.67,34.92 27.3,34.92 27.3,27.3 IC3.10 24.13,27.3 v24.13,21.59 | 26.67,34.92 IC3.16 | 37.47,48.9 v36.2,48.9 | 17.14,56.52 21.59,56.52 21.59,58.42 33.66,58.42 v33.66,48.9 33.66,44.87 R2.2 R3.2 R4.2 | v26.67,36.83 26.67,34.92 | R134.2 R135.2 14.61,32.17 U$1.8 14.68,40.01 | 14.68,40.01 v18.41,40.01 | U1.18 U1.6 14.05,18.49 14.61,17.78 15.24,17.78 15.65,18.01 U1.4 | FTDI.4 11.43,3.81 11.43,9.53 13.23,9.53 U1.18 | v12.7,13.97 12.7,12.7 13.23,12.17 U1.18 | IC4.10 45.09,10.79 45.09,18.41 IC4.16 43.81,18.41 v43.81,19.68 | R1.2 v8.89,24.13 8.89,19.05 R5.2 | v12.7,40.64 14.05,40.64 14.68,40.01 | 33.66,16.64 v33.66,17.14 | R10.2 25.18,15.03 26.67,16.51 33.52,16.51 33.66,16.64 | C1.1 34.66,21.34 C3.A 31.5,21.59 v27.94,21.59 | 33.66,7.62 33.66,16.64 | v8.89,15.24 R6.2
  Top 0.508: v19.05,64.77 18.59,70.94 ULN1.10 | v48.26,60.96 46.53,60.96 ULN2.10 | ULN3.10 v49.53,26.04 | ULN4.10 57.61,12.52 v57.15,12.7 | JP33.1 41.91,3.81 C4.+ | JP26.1 31.75,7.62 33.66,7.62 37.84,7.62 C4.+ | C4.+ 44.45,3.81 v45.72,5.08
  Bottom 0.254: v36.2,48.9 v33.66,48.9 33.66,37.47 26.67,37.47 | 26.67,37.47 v26.67,36.83 | v18.41,40.01 20.32,39.37 26.67,39.37 26.67,37.47 | JP6.3 5.08,12.7 6.35,13.97 8.89,13.97 | 8.89,13.97 v12.7,13.97 | v12.7,40.64 8.89,35.56 v8.89,24.13 v8.89,15.24 8.89,13.97 | v33.66,17.14 33.66,19.68 | 33.66,19.68 v43.81,19.68 | 33.66,19.68 33.66,21.59 v27.94,21.59 v24.13,21.59 | JP27.1 3.81,58.42 3.81,64.77 v19.05,64.77 | JP34.1 53.34,5.08 v45.72,5.08
  Bottom 0.508: v19.05,64.77 48.26,64.77 v48.26,60.96 49.53,59.69 v49.53,26.04 56.52,13.34 v57.15,12.7 48.26,7.62 v45.72,5.08
A0  (via drill 0.6)
  Top 0.254: R2.1 31.75,48.55 | 31.75,48.55 S2.A2 | U1.23 17.14,11.23 17.14,12.06 v15.24,12.7 | v10.16,29.21 v6.35,29.21 | v24.13,50.16 24.77,50.8 31.75,50.8 31.75,48.55
  Bottom 0.254: v15.24,12.7 13.97,15.24 13.97,16.51 10.16,20.32 v10.16,29.21 | v6.35,29.21 6.35,59.05 20.32,59.05 v24.13,50.16
A1  (via drill 0.6)
  Top 0.254: R3.1 v29.21,49.53 | S3.A2 31.91,57.15 v29.21,57.15 v24.13,57.15 | U1.24 18.03,11.81 v15.88,13.97 | v11.43,27.94 7.62,27.94 6.99,27.3 v5.08,27.3
  Bottom 0.254: v29.21,49.53 v29.21,57.15 | v15.88,13.97 14.61,15.24 14.61,17.14 11.43,20.32 v11.43,27.94 | v5.08,27.3 5.08,60.33 22.23,60.33 22.23,57.15 v24.13,57.15
A2  (via drill 0.6)
  Top 0.254: R4.1 v26.67,49.53 | v26.67,61.59 26.67,62.52 S4.A2 | U1.25 18.67,12.45 v15.88,15.24 | v12.7,26.67 7.62,26.67 6.99,26.04 5.08,26.04 v3.81,27.3
  Bottom 0.254: v26.67,49.53 v26.67,61.59 4.45,61.59 4.45,28.57 3.81,27.94 v3.81,27.3 | v15.88,15.24 15.88,17.14 12.7,20.32 v12.7,26.67
A4  (via drill 0.6)
  Top 0.254: U1.27 17.7,14.05 v16.51,17.78 | v13.97,30.48 8.89,30.48 8.89,33.87 R134.1 U$1.5 10.79,39.37 v8.89,39.37 | v7.62,49.53 2.54,53.34 JP27.3
  Bottom 0.254: v16.51,17.78 13.97,20.32 v13.97,30.48 | v8.89,39.37 7.62,39.37 v7.62,49.53
A5  (via drill 0.6)
  Top 0.254: R135.1 12.19,35.39 | 12.19,35.39 12.06,35.77 U$1.6 12.06,40.01 11.43,40.64 8.89,40.64 v8.89,43.18 | U1.28 18.19,14.83 v17.78,17.78 | v13.34,35.56 12.36,35.56 12.19,35.39 | v8.89,46.99 7.62,46.99 3.17,50.8 JP27.4
  Bottom 0.254: v17.78,17.78 15.24,20.32 15.24,33.66 v13.34,35.56 | v8.89,43.18 v8.89,46.99
AREF
  Top 0.254: U1.20 14.62,9.64 C2.1
D2  (via drill 0.6)
  Top 0.254: IC1.14 12.06,52.7 5.08,52.7 5.08,57.15 v3.17,57.15 | U1.32 20.57,18.03 v20.95,18.41 | v18.41,22.23 18.41,22.86 14.61,25.4 v1.91,25.4
  Bottom 0.254: v20.95,18.41 20.95,19.68 v18.41,22.23 | v3.17,57.15 3.17,28.57 1.91,27.3 v1.91,25.4
D3  (via drill 0.6)
  Top 0.254: IC2.11 43.81,43.18 36.2,43.18 36.2,40.64 v26.04,40.64 | IC3.11 21.59,28.57 | 21.59,28.57 21.59,52.7 v20.95,52.7 15.88,52.7 IC1.11 | U1.1 21.59,19.36 21.59,19.68 | 21.59,19.68 21.59,28.57 | IC4.11 39.37,12.06 39.37,19.68 21.59,19.68
  Bottom 0.254: v26.04,40.64 26.04,47.62 20.95,47.62 v20.95,52.7
D4  (via drill 0.6)
  Top 0.254: IC2.12 42.55,43.81 35.56,43.81 35.56,41.91 22.86,41.91 v22.86,45.72 22.23,45.72 22.23,29.84 IC3.12 | IC1.12 14.61,52.07 20.32,52.07 v20.32,45.72 | U1.2 17.14,19.36 v17.14,20.95 | IC4.12 40.01,13.34 40.01,20.32 22.86,20.32 v22.86,24.77
  Bottom 0.254: v22.86,45.72 v20.32,45.72 16.51,41.91 16.51,26.04 17.14,25.4 17.14,24.77 | v17.14,20.95 17.14,24.77 | v22.86,24.77 17.14,24.77
D6  (via drill 0.6)
  Top 0.254: U1.10 11.96,17.25 v12.7,16.51 | R7.1 v27.94,15.24
  Bottom 0.254: v12.7,16.51 12.7,15.24 13.97,13.97 13.97,11.43 16.51,11.43 17.78,12.7 17.78,15.24 19.68,17.14 24.77,17.14 26.67,15.24 v27.94,15.24
D7
  Top 0.254: JP35.1 R5.1 6.13,17.78 8.89,17.78 10.24,16.43 U1.11
D8
  Top 0.254: JP36.1 R6.1 6.13,17.14 8.89,17.14 9.75,15.65 U1.12
D11/MOSI
  Top 0.254: U1.15 6.88,13.23 JP6.2
D12/MISO  (via drill 0.6)
  Top 0.254: U1.16 8,12.45 v7.62,12.06
  Bottom 0.254: v7.62,12.06 6.99,11.43 2.54,11.43 JP8.3
D13/SCK
  Top 0.254: U1.17 7.32,11.12 5.08,8.89 2.54,8.89 JP8.2
DTR
  Top 0.254: FTDI.1 20.32,3.16 C8.2
EIGHT
  Top 0.254: R104.1 R105.1 R106.1 R107.1 R108.1 55.24,56.73 55.24,50.8 49.53,50.8 49.53,34.92 ULN3.17
ELEVEN
  Top 0.254: R116.1 R117.1 R118.1 R119.1 R120.1 R121.1 52.07,42.76 52.07,31.11 ULN3.14
FIVE
  Top 0.254: R91.1 R92.1 R93.1 R94.1 59.69,80.01 59.69,65.41 43.81,65.41 ULN2.12
FIVE_MIN
  Top 0.254: R42.1 R41.1 R40.1 R39.1 6.35,71.12 6.35,73.03 10.79,73.03 ULN1.16
FOUR
  Top 0.254: R87.1 R88.1 R89.1 R90.1 53.76,66.04 42.55,66.04 ULN2.13
GND  (via drill 0.6)
  other vias: 32.38,42.93 27.94,48.26 27.94,54.61 39.37,21.59 26.67,17.78 38.1,3.81 41.91,6.35 7.62,51.44 34.29,59.69 24.13,42.93 24.13,40.64 46.35,44.45 15.24,41.27 10.79,46.35 52.07,54.61 46.99,24.13 57.15,20.32
  pour Top: 0,88.9 80.01,88.9 80.01,0 0,0
  pour Bottom: 0,88.9 76.2,88.9 76.2,0 0,0
HALF
  Top 0.254: R59.1 R60.1 R61.1 R62.1 27.94,80.01 27.94,73.66 15.88,73.66 ULN1.12
IS
  Top 0.254: R38.1 R37.1 6.99,66.04 6.99,72.39 9.53,72.39 ULN1.17
IT
  Top 0.254: R35.1 R36.1 8.26,63.5 ULN1.18
MINUTES
  Top 0.254: R73.1 R72.1 R71.1 R70.1 R69.1 R68.1 R67.1 42.76,69.22 36.2,69.22 ULN2.18
N$1
  Top 0.254: Y1.1 U1.7
N$2
  Top 0.254: R1.1 2.65,24.13 LED1.A
N$3
  Top 0.254: Y1.3 U1.8
N$4
  Top 0.254: U$1.3 12.06,45.09 7.62,45.09 7.62,30.23 BAT1.PWR@1
N$5
  Top 0.254: IC2.14 40.01,45.09 34.29,45.09 34.29,43.81 24.77,43.81 24.77,46.99 22.23,46.99 22.23,55.14 IC1.9
N$6
  Top 0.254: IC2.9 48.26,47.52 48.26,38.1 33.02,38.1 33.02,39.37 23.5,39.37 23.5,32.38 IC3.14
N$7
  Top 0.254: IC4.14 41.27,15.88 41.27,23.5 25.93,23.5 IC3.9
N$8
  Top 0.254: U$2.P$4 20,43.5 17.78,45.72 13.34,45.72 U$1.2
N$9
  Top 0.254: U$1.1 16.65,43.26 U$2.P$1
N$10
  Top 0.254: ULN3.11 52.07,27.3 52.07,24.13 67.31,24.13 JP37.1
N$11
  Top 0.254: ULN4.18 63.5,22.86 JP37.2
N$12
  Top 0.254: ULN4.17 62.23,21.59 JP37.3
N$13
  Top 0.254: ULN4.16 60.96,20.32 JP37.4
N$14
  Top 0.254: ULN4.15 59.69,19.05 JP37.5
N$15
  Top 0.254: ULN4.14 59.69,17.78 64.77,12.7 64.77,11.43 JP37.6
N$16
  Top 0.254: ULN4.13 59.69,16.51 63.5,12.7 63.5,10.16 JP37.7
N$17
  Top 0.254: ULN4.12 59.69,15.24 62.23,12.7 62.23,8.89 JP37.8
N$18
  Top 0.254: ULN4.11 59.69,13.97 60.96,12.7 60.96,7.62 JP37.9
N$19
  Top 0.254: R7.2 30.48,11.85 JP26.2
N$42  (via drill 0.6)
  Top 0.254: v45.09,39.37 IC2.7 | ULN2.8 45.09,52.7 v47.62,50.16
  Bottom 0.254: v47.62,50.16 45.09,47.62 v45.09,39.37
N$43  (via drill 0.6)
  Top 0.254: v43.81,39.37 IC2.6 | ULN2.7 43.81,52.07 v45.72,50.16
  Bottom 0.254: v45.72,50.16 43.81,48.26 v43.81,39.37
N$44  (via drill 0.6)
  Top 0.254: v42.55,39.37 IC2.5 | ULN2.6 42.55,51.44 v43.81,50.16
  Bottom 0.254: v43.81,50.16 42.55,48.9 v42.55,39.37
N$45  (via drill 0.6)
  Top 0.254: v41.27,39.37 IC2.4 | ULN2.5 41.27,50.8 v41.91,50.16
  Bottom 0.254: v41.91,50.16 41.27,49.53 v41.27,39.37
N$46  (via drill 0.6)
  Top 0.254: v40.01,39.37 IC2.3 | ULN2.4 v40.01,50.16
  Bottom 0.254: v40.01,50.16 v40.01,39.37
N$47  (via drill 0.6)
  Top 0.254: v38.73,39.37 IC2.2 | ULN2.3 38.73,50.8 v38.1,50.16
  Bottom 0.254: v38.1,50.16 38.73,49.53 v38.73,39.37
N$48  (via drill 0.6)
  Top 0.254: v37.47,39.37 IC2.1 | ULN2.2 37.47,51.44 v36.2,50.16
  Bottom 0.254: v36.2,50.16 37.47,48.9 v37.47,39.37
N$49
  Top 0.254: IC2.15 38.73,45.72 34.92,45.72 34.92,50.8 36.2,52.07 ULN2.1
N$50  (via drill 0.6)
  Top 0.254: v17.14,50.8 IC1.7 | ULN1.8 17.14,59.69 v19.05,57.78
  Bottom 0.254: v19.05,57.78 17.14,55.88 v17.14,50.8
N$51  (via drill 0.6)
  Top 0.254: v15.88,50.8 IC1.6 | ULN1.7 15.88,59.05 v17.14,57.78
  Bottom 0.254: v17.14,57.78 15.88,56.52 v15.88,50.8
N$52  (via drill 0.6)
  Top 0.254: v14.61,50.8 IC1.5 | ULN1.6 14.61,58.42 v15.24,57.78
  Bottom 0.254: v15.24,57.78 14.61,57.15 v14.61,50.8
N$53  (via drill 0.6)
  Top 0.254: v13.34,50.8 IC1.4 | ULN1.5 v13.34,57.78
  Bottom 0.254: v13.34,57.78 v13.34,50.8
N$54
  Top 0.254: IC3.15 24.13,33.66 24.13,38.1 28.57,38.1 30.48,36.2 ULN3.1
N$55  (via drill 0.6)
  Top 0.254: v17.78,34.92 IC3.1 | ULN3.2 29.84,34.92 v28.57,36.2
  Bottom 0.254: v28.57,36.2 27.3,34.92 v17.78,34.92
N$56  (via drill 0.6)
  Top 0.254: v17.78,33.66 IC3.2 | ULN3.3 29.21,33.66 v28.57,34.29
  Bottom 0.254: v28.57,34.29 27.94,33.66 v17.78,33.66
N$57  (via drill 0.6)
  Top 0.254: v17.78,32.38 IC3.3 | ULN3.4 v28.57,32.38
  Bottom 0.254: v28.57,32.38 v17.78,32.38
N$58  (via drill 0.6)
  Top 0.254: v17.78,31.11 IC3.4 | ULN3.5 29.21,31.11 v28.57,30.48
  Bottom 0.254: v28.57,30.48 27.94,31.11 v17.78,31.11
N$59  (via drill 0.6)
  Top 0.254: v17.78,29.84 IC3.5 | ULN3.6 29.84,29.84 v28.57,28.57
  Bottom 0.254: v28.57,28.57 27.3,29.84 v17.78,29.84
N$60  (via drill 0.6)
  Top 0.254: v17.78,28.57 IC3.6 | ULN3.7 30.48,28.57 v28.57,26.67
  Bottom 0.254: v28.57,26.67 26.67,28.57 v17.78,28.57
N$61  (via drill 0.6)
  Top 0.254: v17.78,27.3 IC3.7 | ULN3.8 31.11,27.3 v28.57,24.77
  Bottom 0.254: v28.57,24.77 26.04,27.3 v17.78,27.3
N$62  (via drill 0.6)
  Top 0.254: v12.06,50.8 IC1.3 | ULN1.4 12.06,58.42 v11.43,57.78
  Bottom 0.254: v11.43,57.78 12.06,57.15 v12.06,50.8
N$63  (via drill 0.6)
  Top 0.254: v10.79,50.8 IC1.2 | ULN1.3 10.79,59.05 v9.53,57.78
  Bottom 0.254: v9.53,57.78 10.79,56.52 v10.79,50.8
N$64  (via drill 0.6)
  Top 0.254: v9.53,50.8 IC1.1 | ULN1.2 9.53,59.69 v7.62,57.78
  Bottom 0.254: v7.62,57.78 9.53,55.88 v9.53,50.8
N$65
  Top 0.254: IC1.15 10.79,53.34 5.71,53.34 5.71,57.78 8.26,60.33 ULN1.1
N$66
  Top 0.254: IC4.15 41.91,17.14 41.91,22.86 ULN4.1
N$67  (via drill 0.6)
  Top 0.254: v35.56,18.41 IC4.1 | ULN4.2 v45.72,21.59
  Bottom 0.254: v45.72,21.59 44.45,18.41 v35.56,18.41
N$68  (via drill 0.6)
  Top 0.254: v35.56,17.14 IC4.2 | ULN4.3 v46.35,20.32
  Bottom 0.254: v46.35,20.32 44.45,17.14 v35.56,17.14
N$69  (via drill 0.6)
  Top 0.254: v35.56,15.88 IC4.3 | ULN4.4 47.62,19.05 v46.35,18.41
  Bottom 0.254: v46.35,18.41 45.09,15.88 v35.56,15.88
N$70  (via drill 0.6)
  Top 0.254: v35.56,14.61 IC4.4 | ULN4.5 48.26,17.78 v46.35,16.51
  Bottom 0.254: v46.35,16.51 45.09,14.61 v35.56,14.61
N$71  (via drill 0.6)
  Top 0.254: v35.56,13.34 IC4.5 | ULN4.6 47.62,16.51 v46.35,14.61
  Bottom 0.254: v46.35,14.61 45.09,13.34 v35.56,13.34
N$72  (via drill 0.6)
  Top 0.254: v35.56,12.06 IC4.6 | ULN4.7 47.62,15.24 46.99,13.34 v46.35,12.7
  Bottom 0.254: v46.35,12.7 44.45,12.06 v35.56,12.06
N$73  (via drill 0.6)
  Top 0.254: v35.56,10.79 IC4.7 | ULN4.8 48.26,13.97 v46.35,10.79
  Bottom 0.254: v46.35,10.79 v35.56,10.79
N$74
  Top 0.254: JP1.1 R35.2
N$75
  Top 0.254: JP1.2 R36.2
N$76
  Top 0.254: JP2.1 R37.2
N$77
  Top 0.254: JP2.2 R38.2
N$78
  Top 0.254: JP3.1 R74.2
N$79
  Top 0.254: JP3.2 R75.2
N$80
  Top 0.254: JP4.1 R43.2
N$81
  Top 0.254: JP4.2 R44.2
N$82
  Top 0.254: JP4.3 R45.2
N$83
  Top 0.254: JP5.1 R76.2
N$84
  Top 0.254: JP5.2 R77.2
N$85
  Top 0.254: JP5.3 R78.2
N$86
  Top 0.254: JP7.1 R79.2
N$87
  Top 0.254: JP7.2 R80.2
N$88
  Top 0.254: JP7.3 R81.2
N$89
  Top 0.254: R87.2 JP14.1
N$90
  Top 0.254: R88.2 JP14.2
N$91
  Top 0.254: R89.2 JP14.3
N$92
  Top 0.254: R90.2 JP14.4
N$93
  Top 0.254: R91.2 JP15.1
N$94
  Top 0.254: R92.2 JP15.2
N$95
  Top 0.254: R93.2 JP15.3
N$96
  Top 0.254: R94.2 JP15.4
N$97
  Top 0.254: R95.2 JP9.1
N$98
  Top 0.254: R96.2 JP9.2
N$99
  Top 0.254: JP9.3 R97.2
N$100
  Top 0.254: JP16.1 R109.2
N$101
  Top 0.254: JP16.2 R110.2
N$102
  Top 0.254: JP16.3 R111.2
N$103
  Top 0.254: JP16.4 R112.2
N$104
  Top 0.254: JP10.1 R113.2
N$105
  Top 0.254: JP10.2 R114.2
N$106
  Top 0.254: JP10.3 R115.2
N$107
  Top 0.254: R46.2 JP25.1
N$108
  Top 0.254: R47.2 JP25.2
N$109
  Top 0.254: R48.2 JP25.3
N$110
  Top 0.254: R49.2 JP25.4
N$111
  Top 0.254: R50.2 JP25.5
N$112
  Top 0.254: R51.2 JP25.6
N$113
  Top 0.254: R52.2 JP25.7
N$114
  Top 0.254: R53.2 JP19.1
N$115
  Top 0.254: R54.2 JP19.2
N$116
  Top 0.254: R55.2 JP19.3
N$117
  Top 0.254: R56.2 JP19.4
N$118
  Top 0.254: R57.2 JP19.5
N$119
  Top 0.254: R58.2 JP19.6
N$120
  Top 0.254: R59.2 JP12.1
N$121
  Top 0.254: R60.2 JP12.2
N$122
  Top 0.254: R61.2 JP12.3
N$123
  Top 0.254: R62.2 JP12.4
N$124
  Top 0.254: R63.2 JP13.1
N$125
  Top 0.254: R64.2 JP13.2
N$126
  Top 0.254: R65.2 JP13.3
N$127
  Top 0.254: R66.2 JP13.4
N$128
  Top 0.254: R67.2 JP24.1
N$129
  Top 0.254: R68.2 JP24.2
N$130
  Top 0.254: R69.2 JP24.3
N$131
  Top 0.254: R70.2 JP24.4
N$132
  Top 0.254: R71.2 JP24.5
N$133
  Top 0.254: R72.2 JP24.6
N$134
  Top 0.254: R73.2 JP24.7
N$135
  Top 0.254: R82.2 JP17.1
N$136
  Top 0.254: R83.2 JP17.2
N$137
  Top 0.254: R84.2 JP17.3
N$138
  Top 0.254: R85.2 JP17.4
N$139
  Top 0.254: R86.2 JP17.5
N$140
  Top 0.254: R98.2 JP20.1
N$141
  Top 0.254: R99.2 JP20.2
N$142
  Top 0.254: R100.2 JP20.3
N$143
  Top 0.254: R101.2 JP20.4
N$144
  Top 0.254: R102.2 JP20.5
N$146
  Top 0.254: R104.2 JP18.1
N$147
  Top 0.254: R105.2 JP18.2
N$148
  Top 0.254: R106.2 JP18.3
N$149
  Top 0.254: R107.2 JP18.4
N$150
  Top 0.254: R108.2 JP18.5
N$151
  Top 0.254: R116.2 JP21.1
N$152
  Top 0.254: R117.2 JP21.2
N$153
  Top 0.254: R118.2 JP21.3
N$154
  Top 0.254: R119.2 JP21.4
N$155
  Top 0.254: R120.2 JP21.5
N$156
  Top 0.254: R121.2 JP21.6
N$157
  Top 0.254: R122.2 JP22.1
N$158
  Top 0.254: JP22.2 R123.2
N$159
  Top 0.254: R124.2 JP22.3
N$160
  Top 0.254: JP22.4 R125.2
N$161
  Top 0.254: R126.2 JP22.5
N$162
  Top 0.254: JP22.6 R127.2
N$163
  Top 0.254: R128.2 JP23.1
N$164
  Top 0.254: R129.2 JP23.2
N$165
  Top 0.254: R130.2 JP23.3
N$166
  Top 0.254: R131.2 JP23.4
N$167
  Top 0.254: R132.2 JP23.5
N$168
  Top 0.254: JP23.6 R133.2
N$169
  Top 0.254: JP11.1 R39.2
N$170
  Top 0.254: JP11.2 R40.2
N$171
  Top 0.254: JP11.3 R41.2
N$172
  Top 0.254: JP11.4 R42.2
NINE
  Top 0.254: R109.1 R110.1 R111.1 R112.1 59.69,50.16 50.16,50.16 50.16,33.66 ULN3.16
O_CLOCK
  Top 0.254: R128.1 R129.1 R130.1 R131.1 R132.1 R133.1 53.34,30.06 53.34,28.57 ULN3.12
ONE
  Top 0.254: R76.1 R77.1 R78.1 45.09,77.47 45.09,67.94 38.73,67.94 ULN2.16
PAST
  Top 0.254: R63.1 R64.1 R65.1 R66.1 27.3,72.39 17.14,72.39 ULN1.11
QUARTER
  Top 0.254: R52.1 R51.1 R50.1 R49.1 R48.1 R47.1 R46.1 8.26,81.06 8.26,74.3 13.34,74.3 ULN1.14
RESET_MC  (via drill 0.6)
  Top 0.254: C8.1 22.23,6.06 S1.A2 27.09,6.06 R10.1 26.67,9.31 v26.67,10.79 | U1.29 20.95,15.65 v20.95,15.24
  Bottom 0.254: v20.95,15.24 21.59,15.24 | 21.59,15.24 22.23,15.24 v26.67,10.79 | JP8.1 2.54,6.35 15.24,6.35 21.59,12.7 21.59,15.24
RX0
  Top 0.254: U1.30 21.67,16.43 22.23,15.88 22.23,10.79 FTDI.3
SEVEN
  Top 0.254: R102.1 R101.1 R100.1 R99.1 R98.1 54.61,58.84 54.61,51.44 48.9,51.44 48.9,36.2 ULN3.18
SIX
  Top 0.254: R95.1 R96.1 R97.1 60.96,72.39 60.96,64.77 45.09,64.77 ULN2.11
TEN
  Top 0.254: R113.1 R114.1 R115.1 50.8,49.11 50.8,32.38 ULN3.15
TEN_MIN
  Top 0.254: R45.1 R44.1 R43.1 6.99,81.28 6.99,73.66 12.06,73.66 ULN1.15
THREE
  Top 0.254: R82.1 R83.1 R84.1 R85.1 R86.1 52.07,77.47 52.07,66.67 41.27,66.67 ULN2.14
TO
  Top 0.254: R74.1 R75.1 44.45,85.09 44.45,68.58 37.47,68.58 ULN2.17
TWELVE
  Top 0.254: R122.1 R123.1 R124.1 R125.1 R126.1 R127.1 52.7,36.41 52.7,29.84 ULN3.13
TWENTY
  Top 0.254: R58.1 R57.1 R56.1 R55.1 R54.1 | R54.1 R53.1 | ULN1.13 14.39,70.94 14.39,75.98 R54.1
TWO
  Top 0.254: R79.1 R80.1 R81.1 46.14,67.31 40.01,67.31 ULN2.15
TX1
  Top 0.254: U1.31 22.12,17.25 22.86,16.51 22.86,8.89 FTDI.2

### Text on the board
tNames: To | Ten | Five | Quarter | Three | Half | One | Five | Twenty | Six | Past | Two | Four | Is | Minutes | Mode | It | Seven | 5v | Hour | GND | SDA | Eight | SCL | Min | Ten | Nine | Eleven | Twelve | O'Clock | 1 | Hr Plus | Hr Minus | 5v | GND | Neo | Open Ports | Word Clock | 5v | by Joe Burke | GND | IN | LED | GND | 5v | 5v | GND | GND | 5v | 9